# EAGLE design Launch-28020_V2_routed (EAGLE 8.5.2)
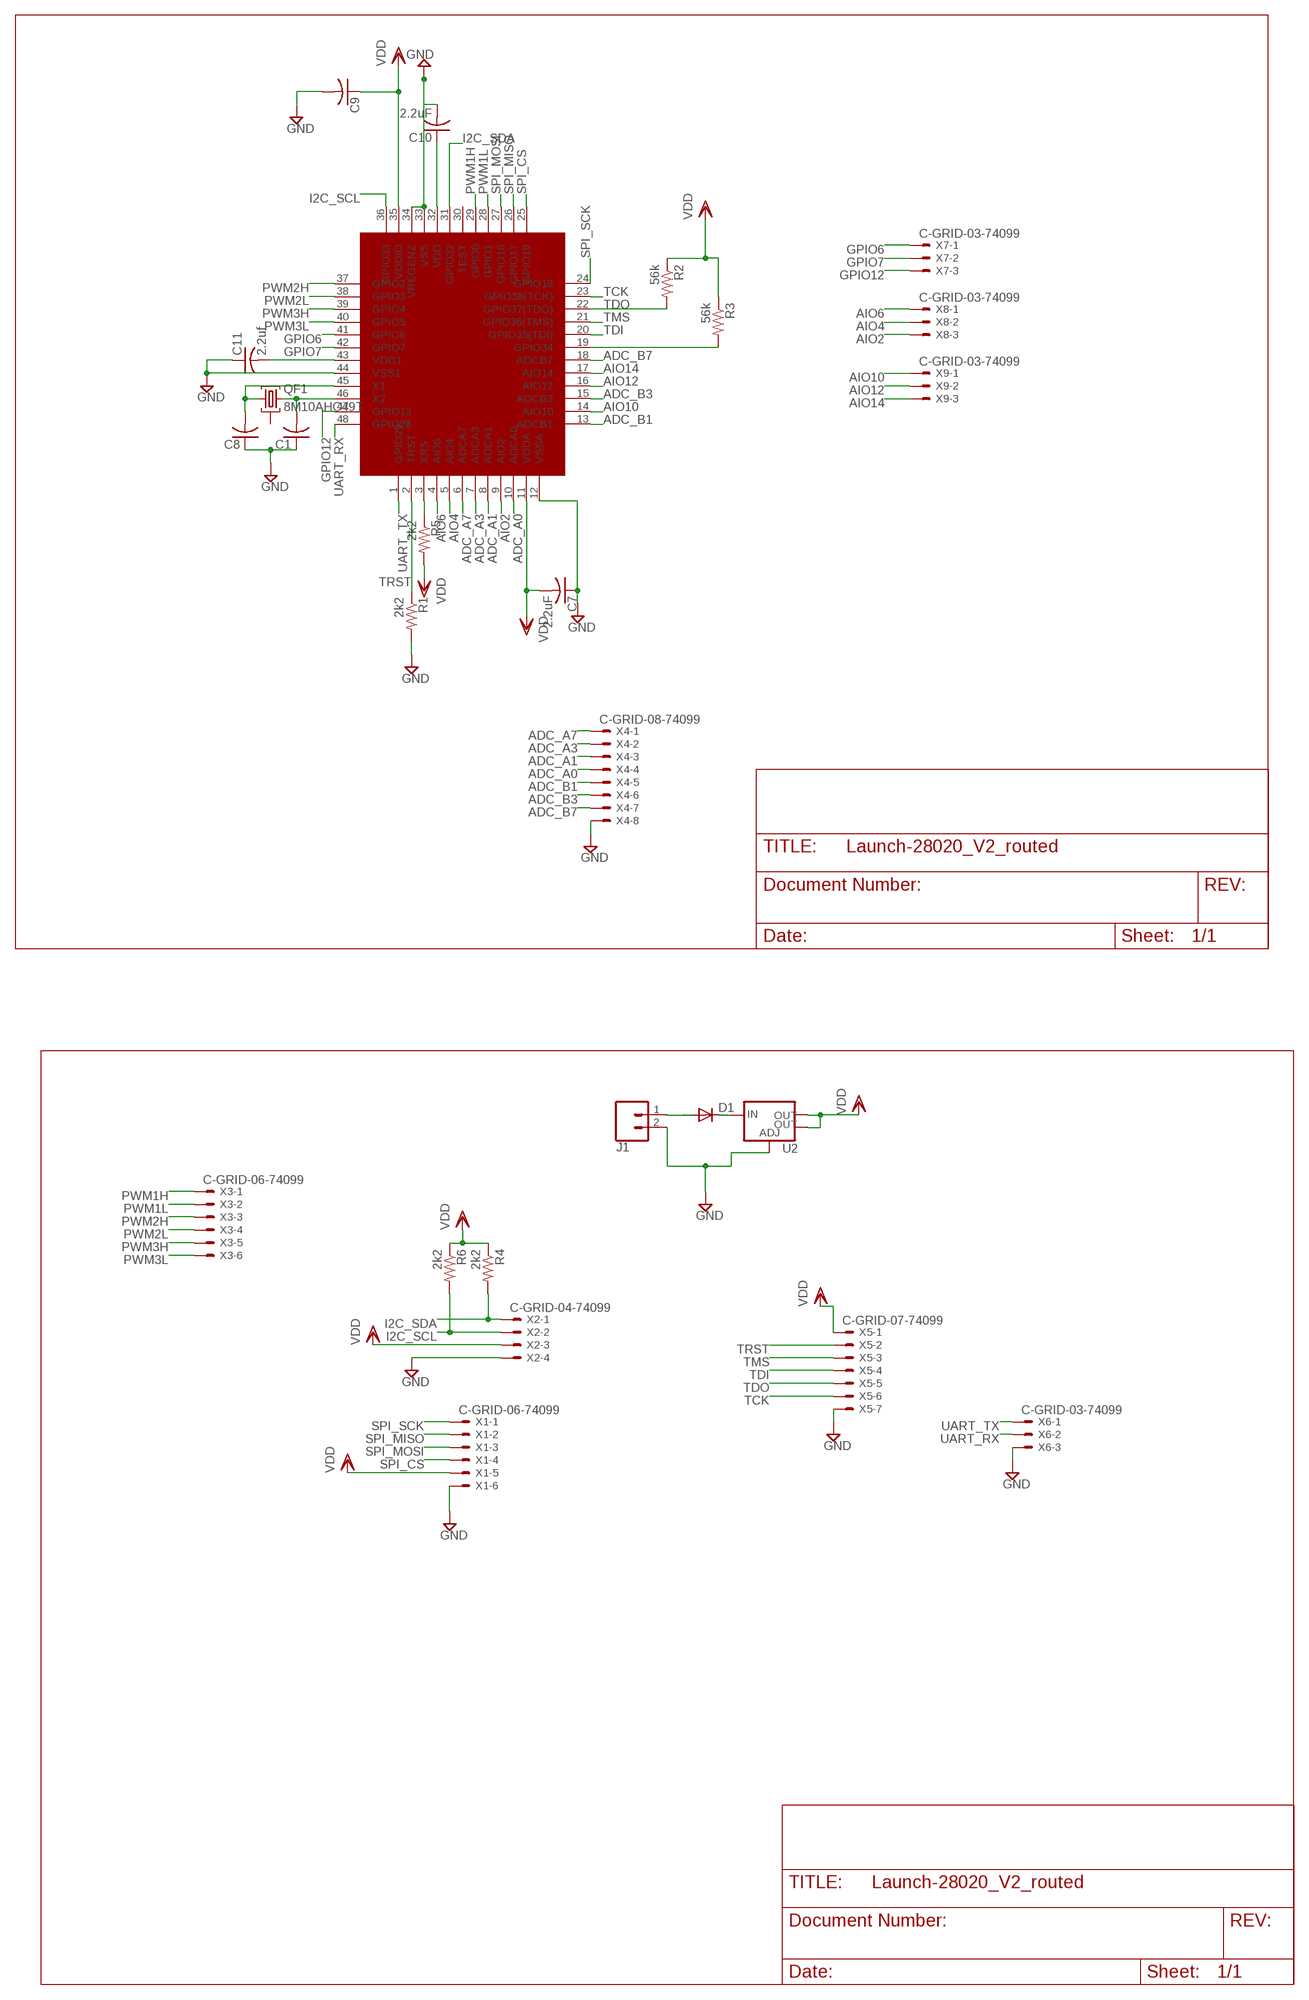
[diagram p0: schematic, sheet 1]

## Parts
C1  C-USC1206  [C1206]
C7  2.2uF  C-USC1206  [C1206]
C8  C-USC1206  [C1206]
C9  C-USC1206  [C1206]
C10  2.2uF  C-USC1206  [C1206]
C11  2.2uf  C-USC1206  [C1206]
D1  DIODE-SOD106-W  [SOD106-W]
J1  CONN_023.5MM-NO_SILK  [SCREWTERMINAL-3.5MM-2-NS]
QF1  8M10AHC49T  [HC49U]
R1  2k2  R-US_M1206  [M1206]
R2  56k  R-US_M1206  [M1206]
R3  56k  R-US_M1206  [M1206]
R4  2k2  R-US_M1206  [M1206]
R5  2k2  R-US_M1206  [M1206]
R6  2k2  R-US_M1206  [M1206]
U2  V_REG_LM1117SOT223  [SOT223]
U$1  TMS320F28020  [LQFP-48]
X1  C-GRID-06-74099  [74099-06]
X2  C-GRID-04-74099  [74099-04]
X3  C-GRID-06-74099  [74099-06]
X4  C-GRID-08-74099  [74099-08]
X5  C-GRID-07-74099  [74099-07]
X6  C-GRID-03-74099  [74099-03]
X7  C-GRID-03-74099  [74099-03]
X8  C-GRID-03-74099  [74099-03]
X9  C-GRID-03-74099  [74099-03]

## Nets
ADC_A0: U$1.10(ADCA0) X4.4
ADC_A1: U$1.8(ADCA1) X4.3
ADC_A3: U$1.7(ADCA3) X4.2
ADC_A7: U$1.6(ADCA7) X4.1
ADC_B1: U$1.13(ADCB1) X4.5
ADC_B3: U$1.15(ADCB3) X4.6
ADC_B7: U$1.18(ADCB7) X4.7
AIO2: U$1.9(AIO2) X8.3
AIO4: U$1.5(AIO4) X8.2
AIO6: U$1.4(AIO6) X8.1
AIO10: U$1.14(AIO10) X9.1
AIO12: U$1.16(AIO12) X9.2
AIO14: U$1.17(AIO14) X9.3
GND: C1.1 C7.1 C8.1 C9.2 C10.2 C11.1 J1.2 R1.2 U2.1(ADJ) U$1.12(VSSA) U$1.33(VSS) U$1.34(VREGENZ) U$1.44(VSS1) X1.6 X2.4 X4.8 X5.7 X6.3
GPIO6: U$1.41(GPIO6) X7.1
GPIO7: U$1.42(GPIO7) X7.2
GPIO12: U$1.47(GPIO12) X7.3
I2C_SCL: R6.2 U$1.36(GPIO33) X2.2
I2C_SDA: R4.2 U$1.31(GPIO32) X2.1
N$1: D1.A J1.1
N$3: C10.1 U$1.32(VDD)
N$4: C11.2 U$1.43(VDD1)
N$5: R5.1 U$1.3(XRS)
N$6: C8.2 QF1.1 U$1.45(X1)
N$7: C1.2 QF1.3 U$1.46(X2)
N$8: D1.C U2.3(IN)
N$12: R3.2 U$1.19(GPIO34)
PWM1H: U$1.29(GPIO0) X3.1
PWM1L: U$1.28(GPIO1) X3.2
PWM2H: U$1.37(GPIO2) X3.3
PWM2L: U$1.38(GPIO3) X3.4
PWM3H: U$1.39(GPIO4) X3.5
PWM3L: U$1.40(GPIO5) X3.6
SPI_CS: U$1.25(GPIO19) X1.4
SPI_MISO: U$1.26(GPIO17) X1.2
SPI_MOSI: U$1.27(GPIO16) X1.3
SPI_SCK: U$1.24(GPIO18) X1.1
TCK: U$1.23(GPIO38(TCK)) X5.6
TDI: U$1.20(GPIO35(TDI)) X5.4
TDO: R2.2 U$1.22(GPIO37(TDO)) X5.5
TMS: U$1.21(GPIO36(TMS)) X5.3
TRST: R1.1 U$1.2(TRST) X5.2
UART_RX: U$1.48(GPIO28) X6.2
UART_TX: U$1.1(GPIO29) X6.1
VDD: C7.2 C9.1 R2.1 R3.1 R4.1 R5.2 R6.1 U2.2(OUT) U2.4(OUT) U$1.11(VDDA) U$1.35(VDDIO) X1.5 X2.3 X5.1
Unconnected: QF1.2 U$1.30(TEST)

## Library data of the parts
C1 C7-C11 = rcl:C-US: CAPACITOR, American symbol
D1 = diode:DIODE-: DIODE
J1 = SparkFun-Connectors:CONN_02: Multi connection point. Often used as Generic Header-pin footprint for 0.1 inch spaced/style header connections On any of the 0.1 inch spaced packages, you can populate with these: Break Away Headers - Straight <https://www.sparkfun.com/products/116> (PRT-00116) Break Away Male Headers - Right Angle <https://www.sparkfun.com/products/553> (PRT-00553) Female Headers <https://www.sparkfun.com/products/115> (PRT-00115) Break Away Headers - Machine Pin <https://www.sparkfun.com/products/117> (PRT-00117) Break Away Female Headers - Swiss Machine Pin <https://www.sparkfun.com/products/743> (PRT-00743) For SCREWTERMINALS and SPRING TERMINALS visit here: Screw Terimnals on SparkFun.com <https://www.sparkfun.com/search/results?term=Screw+Terminals> (5mm/3.5mm/2.54mm spacing) This device is also useful as a general connection point to wire up your design to another part of your project. Our various solder wires solder well into these plated through hole pads. Hook-Up Wire - Assortment (Stranded, 22 AWG) <https://www.sparkfun.com/products/11375> (PRT-11375) Hook-Up Wire - Assortment (Solid Core, 22 AWG) <https://www.sparkfun.com/products/11367> (PRT-11367) View the entire wire category on our website here <https://www.sparkfun.com/categories/141> Special notes: Molex polarized connector foot print use with: PRT-08233 with associated crimp pins and housings. 2.54_SCREWTERM for use with PRT-10571. 3.5mm Screw Terminal footprints for PRT-08084 5mm Screw Terminal footprints for use with PRT-08432; PROD_ID: CONN-08399
QF1 = crystal:8M10AHC49T: Monolithic Crystal Filters Source: www.vanlong.com; OC_FARNELL: unknown; OC_NEWARK: unknown
R1-R6 = resistor:R-US_: RESISTOR, American symbol
U2 = SparkFun-IC-Power:V_REG_LM1117: Voltage Regulator LM1117 Standard adjustable voltage regulator but in SMD form. Spark Fun Electronics SKU : COM-00595; PROD_ID: VREG-08170
U$1 = TMS320F28020:TMS320F28020
X1 X3 = con-molex:C-GRID-06: CONNECTOR wire to board 2.54 mm (0.100") pitch header; OC_FARNELL: unknown; OC_NEWARK: unknown
X2 = con-molex:C-GRID-04: CONNECTOR wire to board 2.54 mm (0.100") pitch header; OC_FARNELL: unknown; OC_NEWARK: unknown
X4 = con-molex:C-GRID-08: CONNECTOR wire to board 2.54 mm (0.100") pitch header; OC_FARNELL: unknown; OC_NEWARK: unknown
X5 = con-molex:C-GRID-07: CONNECTOR wire to board 2.54 mm (0.100") pitch header; OC_FARNELL: unknown; OC_NEWARK: unknown
X6-X9 = con-molex:C-GRID-03: CONNECTOR wire to board 2.54 mm (0.100") pitch header; OC_FARNELL: unknown; OC_NEWARK: unknown

## Board
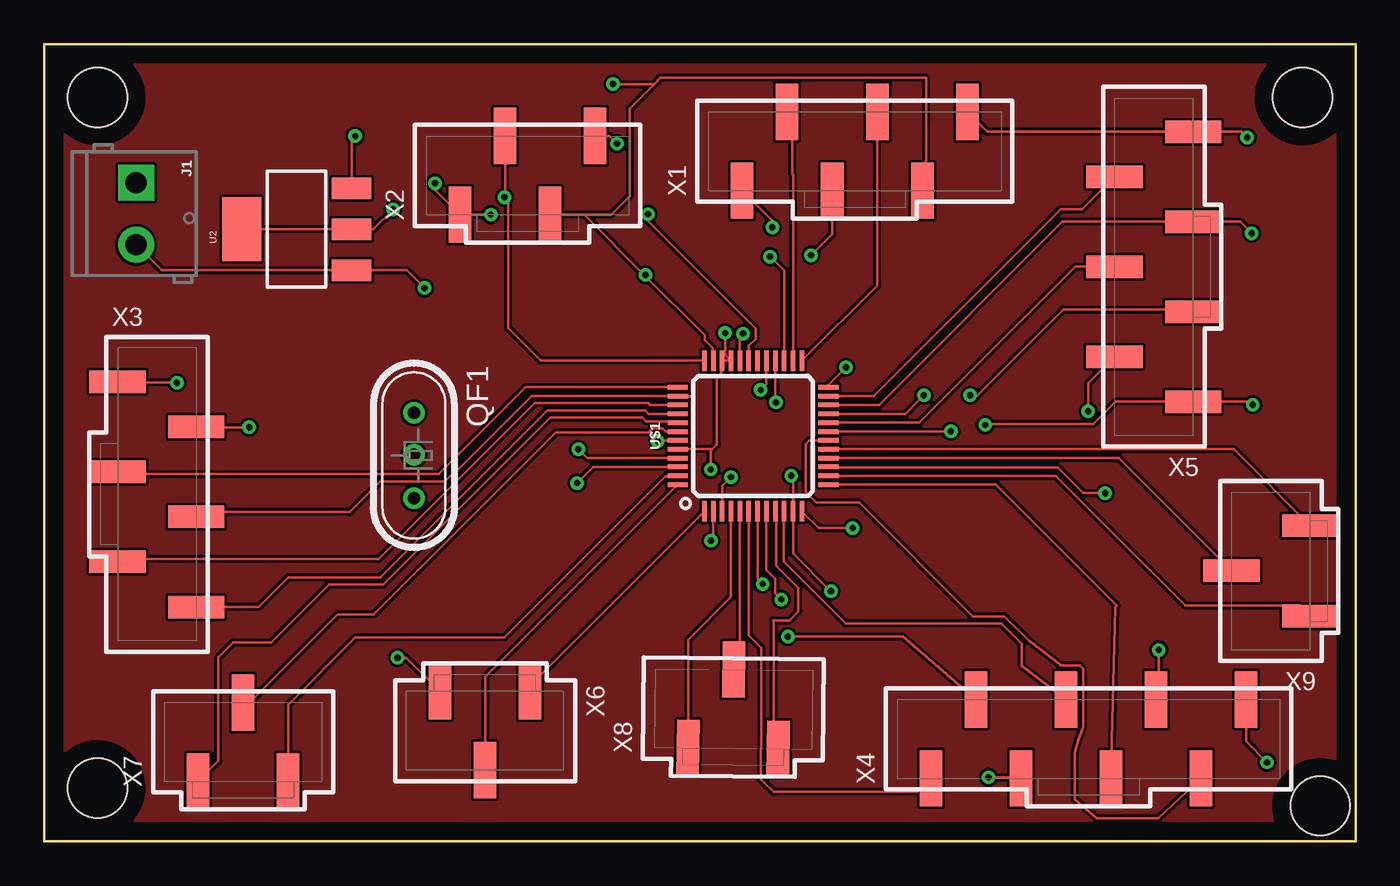
[diagram p1: board, top side]
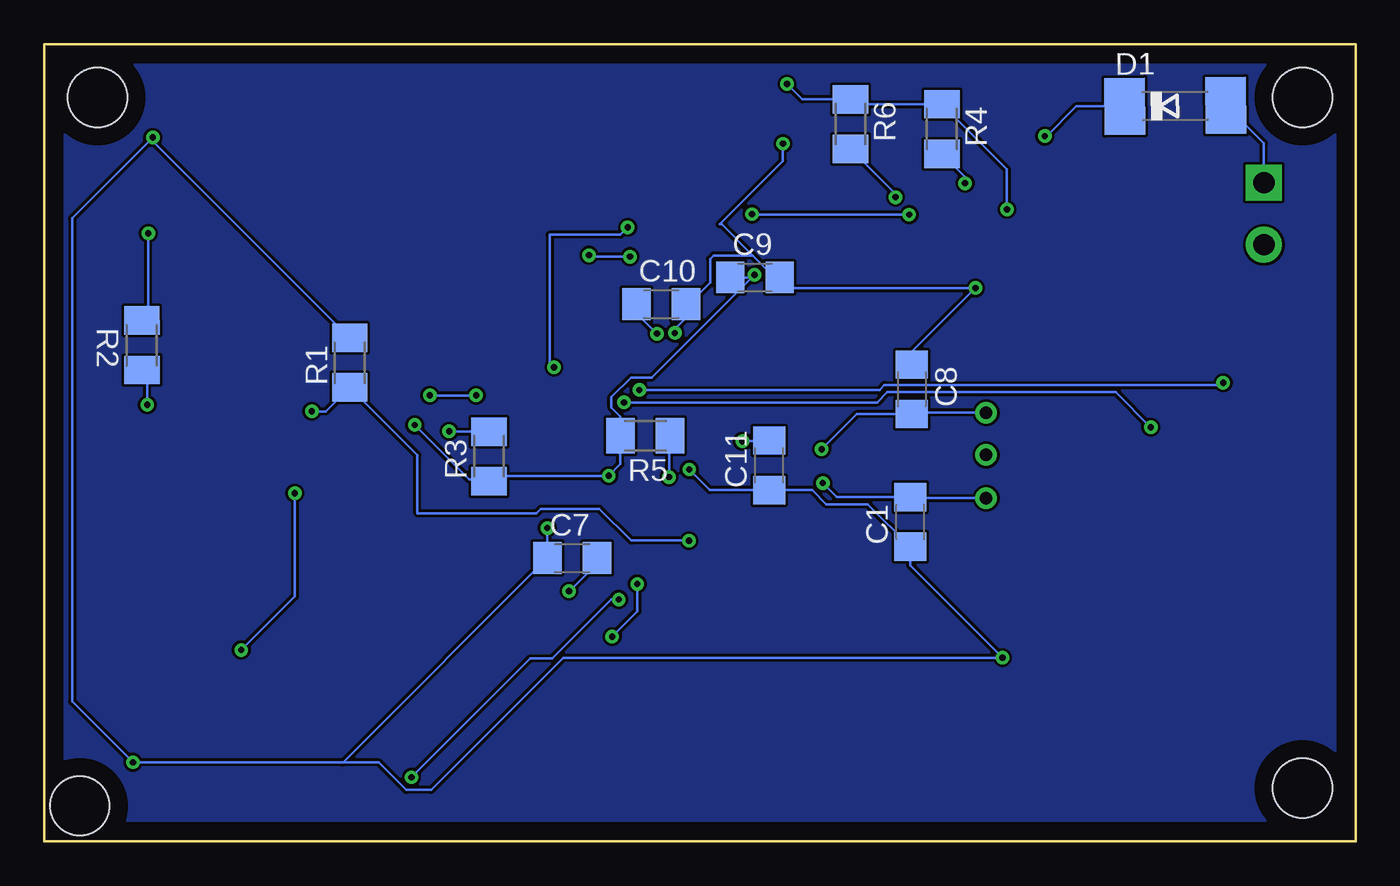
[diagram p2: board, bottom side, seen from below]

Size 74 x 45 mm. Coordinates in mm from the lower left corner, seen from the top.
Outline: 0,0 74,0 74,45 0,45 0,0
Copper layers (1*16): Top 0.035mm / dielectric 1.5mm / Bottom 0.035mm
Design rules "default *": minimum track width 6mil, minimum drill 0.35mm, track to track 6mil, track to pad 6mil, pad to pad 6mil, via to via 6mil, smd to smd 6mil, copper to edge 40mil, drill to drill 6mil, minimum pad ring 10mil, minimum via ring 8mil, stop-mask expansion 4mil, vias tented up to drill 0mil, thermal gap 10mil
Holes 3.36 mm at 3,42 71,42 72,2 3,3

### Footprints (pad centres in the part's own frame; a part is rotated, then mirrored left to right if it is on the bottom)
C1206 = smd 1.6 x 1.8: 1 -1.4,0; 2 1.4,0
SOD106-W = smd 2.3 x 3.2: A 2.85,0; C -2.85,0
SCREWTERMINAL-3.5MM-2-NS = drill 1.2 pad 2.032 square: 1 0,0 | drill 1.2 pad 2.032: 2 3.5,0
HC49U = drill 0.7 pad 1.2: 1 -2.413,0; 2 -0.027,0; 3 2.413,0
M1206 = smd 1.6 x 2: 1 -1.4,0; 2 1.4,0
SOT223 = smd 1.219 x 2.235: 1 -2.311,-3.099; 2 0,-3.099; 3 2.311,-3.099 | smd 3.6 x 2.2: 4 0,3.099
LQFP-48 = smd 0.254 x 1.143: 1 -2.75,-4.25; 2 -2.25,-4.25; 3 -1.75,-4.25; 4 -1.25,-4.25; 5 -0.75,-4.25; 6 -0.25,-4.25; 7 0.25,-4.25; 8 0.75,-4.25; 9 1.25,-4.25; 10 1.75,-4.25; 11 2.25,-4.25; 12 2.75,-4.25; 25 2.75,4.25; 26 2.25,4.25; 27 1.75,4.25; 28 1.25,4.25; 29 0.75,4.25; 30 0.25,4.25; 31 -0.25,4.25; 32 -0.75,4.25; 33 -1.25,4.25; 34 -1.75,4.25; 35 -2.25,4.25; 36 -2.75,4.25 | smd 1.143 x 0.254: 13 4.25,-2.75; 14 4.25,-2.25; 15 4.25,-1.75; 16 4.25,-1.25; 17 4.25,-0.75; 18 4.25,-0.25; 19 4.25,0.25; 20 4.25,0.75; 21 4.25,1.25; 22 4.25,1.75; 23 4.25,2.25; 24 4.25,2.75; 37 -4.25,2.75; 38 -4.25,2.25; 39 -4.25,1.75; 40 -4.25,1.25; 41 -4.25,0.75; 42 -4.25,0.25; 43 -4.25,-0.25; 44 -4.25,-0.75; 45 -4.25,-1.25; 46 -4.25,-1.75; 47 -4.25,-2.25; 48 -4.25,-2.75
74099-06 = smd 1.27 x 3.175: 1 -6.35,-2.223; 2 -3.81,2.223; 3 -1.27,-2.223; 4 1.27,2.223; 5 3.81,-2.223; 6 6.35,2.223
74099-04 = smd 1.27 x 3.175: 1 -3.81,-2.223; 2 -1.27,2.223; 3 1.27,-2.223; 4 3.81,2.223
74099-08 = smd 1.27 x 3.175: 1 -8.89,-2.223; 2 -6.35,2.223; 3 -3.81,-2.223; 4 -1.27,2.223; 5 1.27,-2.223; 6 3.81,2.223; 7 6.35,-2.223; 8 8.89,2.223
74099-07 = smd 1.27 x 3.175: 1 -7.62,-2.223; 2 -5.08,2.223; 3 -2.54,-2.223; 4 0,2.223; 5 2.54,-2.223; 6 5.08,2.223; 7 7.62,-2.223
74099-03 = smd 1.27 x 3.175: 1 -2.54,-2.223; 2 0,2.223; 3 2.54,-2.223

### Placement (x,y rotation side)
C1  25.14,18.03 90 bottom
C7  44.21,15.99 0 bottom
C8  25.05,25.52 270 bottom
C9  33.9,31.84 0 bottom
C10  39.19,30.33 0 bottom
C11  33.1,21.23 90 bottom
D1  10.18,41.52 0.6 bottom
J1  5.18,37.19 270 top
QF1  20.85,21.79 270 top
R1  56.76,27.03 90 bottom
R2  68.5,28.01 90.1 bottom
R3  48.91,21.73 90 bottom
R4  23.36,40.21 270 bottom
R5  40.09,22.89 180 bottom
R6  28.51,40.49 270 bottom
U2  14.24,34.56 90 top
U$1  40,22.89 0 top
X1  45.73,38.96 0 top
X2  27.27,37.6 0 top
X3  6.36,19.58 270 top
X4  58.92,5.78 0 top
X5  62.62,32.44 90 top
X6  24.87,6.24 180 top
X7  11.21,5.61 0 top
X8  38.89,7.47 359.4 top
X9  69.22,15.27 90 top

### Tracks (layer width: path | path; a pad name or v marks a point on that pad's centre or on a via)
ADC_A0
  Top 0.152: U$1.10 41.71,18.6 41.71,15.79 45.21,12.29 54.01,12.29 55.17,11.14 55.17,9.9 X4.4
ADC_A1  (via drill 0.35)
  Top 0.152: U$1.8 40.75,15.32 41.25,14.82 41.25,13.99 v41.59,13.65 | v53.28,3.61 55.06,3.61 X4.3
  Bottom 0.152: v41.59,13.65 42,13.65 45.33,10.32 46.57,10.32 v53.28,3.61
ADC_A3  (via drill 0.35)
  Top 0.152: U$1.7 40.25,14.82 v40.54,14.53 | v41.96,11.56 48.43,11.56 X4.2
  Bottom 0.152: v40.54,14.53 40.54,12.97 v41.96,11.56
ADC_A7
  Top 0.152: U$1.6 39.75,11.64 40.46,10.92 40.46,6.96 40.42,3.51 40.61,3.31 40.64,3.31 41.17,2.78 49.25,2.78 X4.1
ADC_B1
  Top 0.152: U$1.13 53.69,20.14 60.52,13.31 60.43,13.23 X4.5
ADC_B3  (via drill 0.35)
  Top 0.152: U$1.15 44.29,21.09 57.19,21.09 58.63,19.65 v59.86,19.65 | v62.88,10.8 62.88,8.16 X4.6
  Bottom 0.152: v59.86,19.65 59.86,13.82 v62.88,10.8
ADC_B7
  Top 0.152: X4.7 62.87,1.31 59.38,1.31 58.15,2.36 58.15,5.04 58.34,5.69 58.62,6.47 58.62,9.73 58.42,9.93 57.39,9.93 55.58,11.31 54.18,12.7 52.4,12.7 45.98,19.12 43.55,19.12 42.96,19.71 42.96,22.44 43.15,22.64 U$1.18
AIO2
  Top 0.152: 41.25,5.38 X8.3 41.16,5.47 41.16,12.44 41.12,12.48 42.06,12.48 42.55,12.97 42.55,14.3 41.31,15.54 41.31,17.91 41.29,17.93 41.29,18.59 U$1.9
AIO4
  Top 0.152: U$1.5 39.25,10.03 X8.2
AIO6
  Top 0.152: U$1.4 38.75,13.79 36.35,11.39 36.35,5.3 X8.1
AIO10
  Top 0.152: U$1.14 57.07,20.64 64.38,13.33 70.83,13.33 X9.1
AIO12
  Top 0.152: U$1.16 60.62,21.64 X9.2
AIO14
  Top 0.152: U$1.17 67.11,22.14 X9.3
GND  (via drill 0.35)
  Top 0.152: J1.2 6.62,32.24 U2.1 20.45,32.24 v21.46,31.24 | 38.28,27.14 U$1.33 38.42,27.47 v38.42,28.7 | 38.28,27.14 U$1.34 | X6.3 20.43,10.37 v19.93,10.37 | 37.6,22.14 U$1.44 | 37.6,22.14 37.69,22.14 37.95,22.4 37.95,26.18 38.21,26.43 38.21,27.06 38.28,27.14 | X1.6 53.21,40.06 X5.7 67.55,40.06 v67.88,39.74 | v32.32,39.39 31.89,39.82 X2.4 | v68.99,4.46 67.81,5.64 X4.8 | v37.6,20.99 37.6,22.14 | U$1.12 43.7,17.68 v45.61,17.68
  Bottom 0.152: 37.79,30.19 C10.2 | 37.79,30.19 37.79,29.57 38.66,28.7 v38.42,28.7 | C8.1 25.05,27.64 v21.46,31.24 31.9,31.24 C9.2 32.79,31.84 34.02,33.07 | 37.79,30.19 36.43,31.55 36.43,32.88 36.23,33.07 34.02,33.07 | 34.02,33.07 35.78,34.84 35.89,34.84 32.32,38.41 v32.32,39.39 | 57.14,4.46 C7.1 v45.61,17.68 | 57.14,4.46 57.19,4.46 v68.99,4.46 72.43,7.9 72.43,35.18 v67.88,39.74 67.88,39.54 R1.2 | v37.6,20.99 36.44,19.83 C11.1 30.67,19.83 29.87,19.03 27.53,19.03 C1.1 25.14,15.58 v19.93,10.37 44.71,10.37 52.17,2.9 53.58,2.9 55.13,4.46 57.14,4.46
GPIO6
  Top 0.152: X7.1 9.82,4.53 9.82,10.38 10.67,11.24 12.81,11.24 16.07,14.5 19.13,14.5 28.56,23.92 33.74,23.92 33.96,23.7 34.64,23.7 34.78,23.7 35.68,23.7 U$1.41
GPIO7
  Top 0.152: U$1.42 35.06,23.14 34.9,23.3 34.31,23.3 34.1,23.08 28.85,23.08 18.59,12.81 16.56,12.81 11.58,7.84 X7.2
GPIO12
  Top 0.152: U$1.47 35.71,20.59 35.04,20.59 25.96,11.51 17.55,11.51 13.75,7.71 X7.3
I2C_SCL  (via drill 0.35)
  Top 0.152: 26,36.39 v25.97,36.37 | 26,36.39 X2.2 | U$1.36 28.01,27.14 26.17,28.98 26.17,36.22 26,36.39
  Bottom 0.152: R6.2 25.97,36.55 v25.97,36.37
I2C_SDA  (via drill 0.35)
  Top 0.152: v22.04,37.15 22.04,36.79 X2.1 v25.19,35.38 v25.2,35.38 | U$1.31 39.75,27.98 40.14,28.37 40.14,28.96 34.06,35.03 v34.06,35.41
  Bottom 0.152: v22.04,37.15 22.04,37.5 R4.2 | v25.2,35.38 34.04,35.38 v34.06,35.41
N$1
  Bottom 0.152: J1.1 5.18,39.41 D1.A
N$2
  pour Top: 0,45 74,45 74,0 0,0
N$3  (via drill 0.35)
  Top 0.152: U$1.32 39.25,28.48 v39.43,28.66
  Bottom 0.152: v39.43,28.66 40.59,29.82 C10.1
N$4  (via drill 0.35)
  Top 0.152: U$1.43 34.66,22.64 v34.61,22.59
  Bottom 0.152: v34.61,22.59 33.14,22.59 C11.2
N$5  (via drill 0.35)
  Top 0.152: U$1.3 38.25,20.06 v38.75,20.56
  Bottom 0.152: v38.75,20.56 38.75,22.83 R5.1
N$6  (via drill 0.35)
  Top 0.152: v30.14,22.14 30.64,21.64 U$1.45
  Bottom 0.152: QF1.1 24.98,24.2 C8.2 28.15,24.12 v30.14,22.14
N$7  (via drill 0.35)
  Top 0.152: U$1.46 30.98,21.14 v30.07,20.23
  Bottom 0.152: v30.07,20.23 29.28,19.43 C1.2 25.08,19.37 QF1.3
N$8  (via drill 0.35)
  Top 0.152: v17.54,39.81 17.34,39.61 U2.3
  Bottom 0.152: D1.C 15.77,41.49 17.49,39.76 v17.54,39.81
N$9
  pour Bottom: 0,45 74,45 74,0 0,0
N$12  (via drill 0.35)
  Top 0.152: U$1.19 51.15,23.14 v51.16,23.15
  Bottom 0.152: v51.16,23.15 48.92,23.15 R3.2
PWM1H  (via drill 0.35)
  Top 0.152: U$1.29 40.75,25.81 v40.42,25.49 | v7.48,25.89 4.18,25.89 X3.1
  Bottom 0.152: v40.42,25.49 26.87,25.49 26.59,25.76 7.61,25.76 v7.48,25.89
PWM1L  (via drill 0.35)
  Top 0.152: U$1.28 41.25,24.82 v41.29,24.78 | v11.56,23.37 8.6,23.37 X3.2
  Bottom 0.152: v41.29,24.78 27,24.78 26.42,25.36 13.54,25.36 v11.56,23.37
PWM2H
  Top 0.152: X3.3 4.25,20.74 20,20.74 20,20.73 22.26,20.73 27.17,25.64 U$1.37
PWM2L
  Top 0.152: U$1.38 35.79,25.09 36.41,25.09 36.41,25.14 27.5,25.14 23.1,20.74 23.01,20.74 22.59,20.33 18.97,20.33 17.23,18.59 9.04,18.59 8.76,18.31 X3.4
PWM3H
  Top 0.152: U$1.39 34.17,24.64 34.07,24.73 27.67,24.73 18.87,15.94 4.3,15.94 X3.5
PWM3L
  Top 0.152: U$1.40 34.1,24.14 33.91,24.33 28.39,24.33 18.96,14.9 13.76,14.9 12.1,13.24 10.94,13.24 10.93,13.23 X3.6
SPI_CS
  Top 0.152: U$1.25 47,31.39 X1.4
SPI_MISO
  Top 0.152: U$1.26 42.25,37.63 42.21,37.67 42.21,40.9 X1.2
SPI_MOSI  (via drill 0.35)
  Top 0.152: U$1.27 41.75,32.21 v40.95,33.01 | v43.27,33.09 44.46,34.28 X1.3
  Bottom 0.152: v40.95,33.01 43.19,33.01 v43.27,33.09
SPI_SCK  (via drill 0.35)
  Top 0.152: X1.1 41.08,35.04 v41.08,34.66 | v45.24,26.76 44.25,25.77 U$1.24
  Bottom 0.152: v41.08,34.66 41.5,34.25 45.48,34.25 45.48,27 v45.24,26.76
TCK
  Top 0.152: U$1.23 46.81,25.14 57.37,35.69 58.56,35.69 X5.6
TDI
  Top 0.152: U$1.20 49.36,23.64 58.17,32.44 X5.4
TDO  (via drill 0.35)
  Top 0.152: U$1.22 47.11,24.64 57.45,34.98 64.76,34.98 X5.5 67.47,34.98 v68.13,34.33
  Bottom 0.152: R2.2 68.13,29.78 v68.13,34.33
TMS  (via drill 0.35)
  Top 0.152: U$1.21 48.59,24.14 v49.63,25.18 | v52.24,25.18 52.65,25.18 57.49,30.02 64.72,30.02 X5.3
  Bottom 0.152: v49.63,25.18 v52.24,25.18
TRST  (via drill 0.35)
  Top 0.152: U$1.2 37.75,17.1 v37.62,16.97 | v58.9,24.28 58.9,25.87 X5.2
  Bottom 0.152: v37.62,16.97 40.88,16.97 42.68,18.77 45.98,18.77 46.24,18.51 52.95,18.51 52.95,21.81 R1.1 58.11,24.28 v58.9,24.28
UART_RX
  Top 0.152: U$1.48 24.89,9.28 24.89,4.81 25.33,4.38 25.23,4.38 X6.2
UART_TX
  Top 0.152: U$1.1 27.41,8.8 X6.1
VDD  (via drill 0.35)
  Top 0.152: U2.4 U2.2 18.56,34.56 v19.68,35.67 | v42.15,20.64 42.25,20.54 U$1.11 42.25,16.26 v44.39,14.12 | U$1.35 37.71,27.18 37.71,27.84 37.26,28.29 37.26,28.57 33.92,31.92 | 33.92,31.92 30.46,35.38 | 30.46,35.38 X2.3 | v33.93,31.98 33.93,31.93 33.92,31.92 | v68.19,24.65 68.02,24.82 X5.1 60.45,24.82 59.2,23.57 53.16,23.57 v53.1,23.51 | X1.5 49.76,38.51 49.76,43.1 47.77,43.1 34.77,43.12 34.62,42.97 34.61,42.95 34.41,42.76 | 34.41,42.76 33.03,41.37 33.03,36.42 31.98,35.38 30.46,35.38 | v32.09,42.76 34.41,42.76
  Bottom 0.152: v19.68,35.67 19.68,37.94 R4.1 28.23,41.62 R6.1 31.23,41.89 v32.09,42.76 | C9.1 34.07,31.84 v33.93,31.98 39.71,26.2 40.87,26.2 42,25.07 42,24.48 41.49,23.98 R5.2 41.49,21.3 v42.15,20.64 48.6,20.64 48.8,20.44 | v44.39,14.12 42.81,15.7 C7.2 | 48.8,20.44 R3.1 | v68.19,24.65 68.19,26.31 R2.1 | v53.1,23.51 50.03,20.44 48.8,20.44